# Altium schematic sheet 10_POWER.SchDoc
size A; SheetNumber: 2; SheetTotal: 8
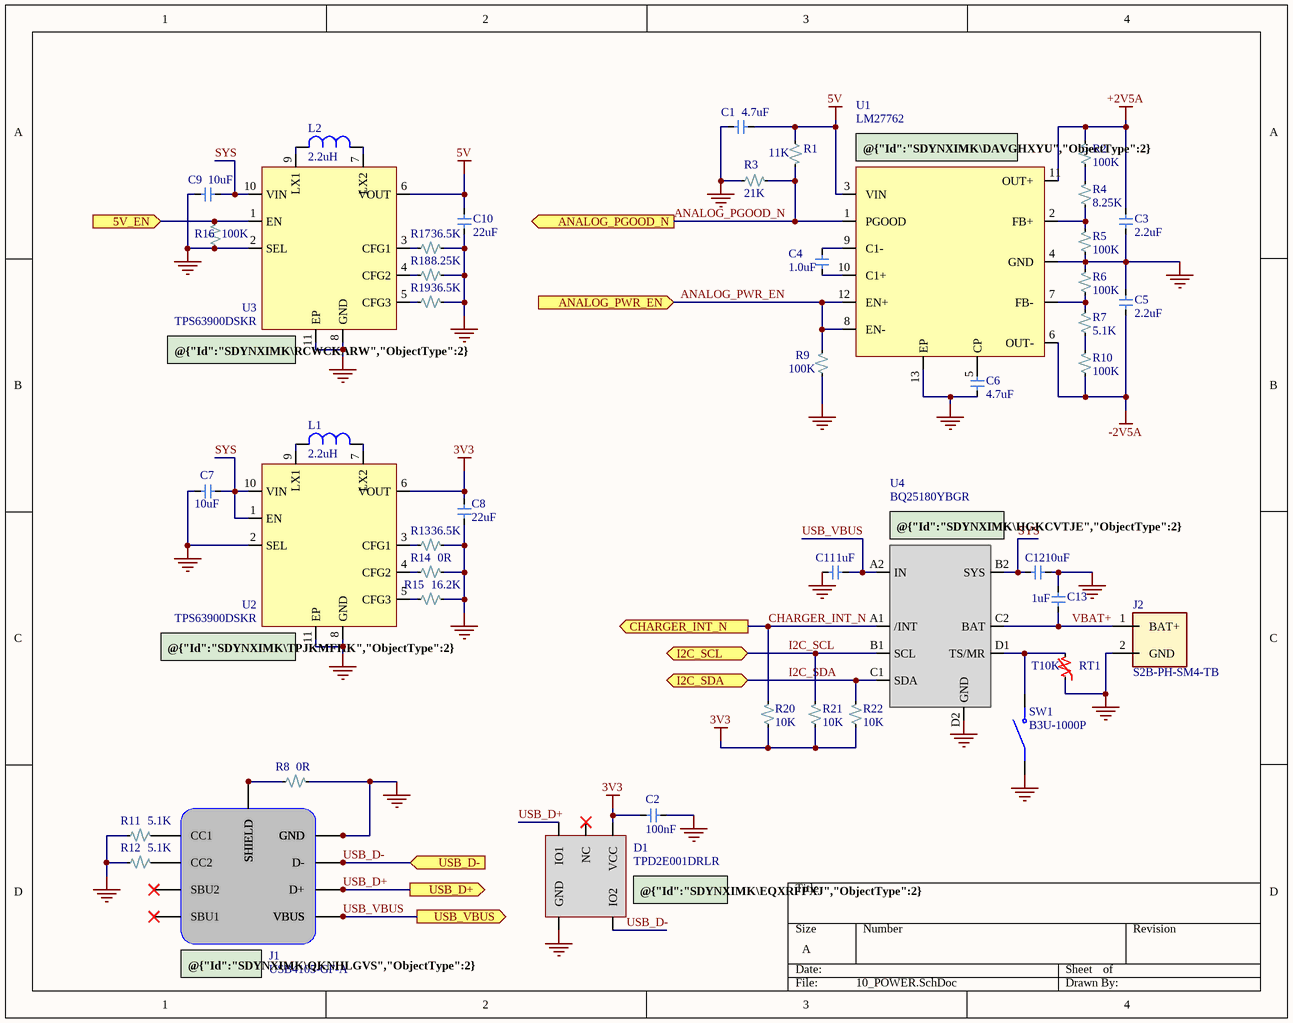
[diagram p0: 10_POWER.SchDoc]

## Parts
C1  4.7uF  [C0805]
C2  100nF  [C0805]
C3  2.2uF  [C0805]
C4  1.0uF  [C0805]
C5  2.2uF  [C0805]
C6  4.7uF  [C0805]
C7  10uF  [C0805]
C8  22uF  [C0805]
C9  10uF  [C0805]
C10  22uF  [C0805]
C11  1uF  [C0805]
C12  10uF  [C0805]
C13  1uF  [C0805]
D1  TPD2E001DRLR  [TPD2E001DRLR]
J1  USB4105-GF-A  [USB4105-GF-A]
J2  S2B-PH-SM4-TB  [S2B-PH-SM4-TB]
L1  2.2uH  [WE_PMCI_201210]
L2  2.2uH  [WE_PMCI_201210]
R1  11K  [R0805]
R2  100K  [R0805]
R3  21K  [R0805]
R4  8.25K  [R0805]
R5  100K  [R0805]
R6  100K  [R0805]
R7  5.1K  [R0805]
R8  0R  [R0805]
R9  100K  [R0805]
R10  100K  [R0805]
R11  5.1K  [R0805]
R12  5.1K  [R0805]
R13  36.5K  [R0805]
R14  0R  [R0805]
R15  16.2K  [R0805]
R16  100K  [R0805]
R17  36.5K  [R0805]
R18  8.25K  [R0805]
R19  36.5K  [R0805]
R20  10K  [R0805]
R21  10K  [R0805]
R22  10K  [R0805]
RT1  T10K  [NCU18_1608]
SW1  B3U-1000P  [B3U-1000P]
U1  LM27762  [LM27762]
U2  TPS63900DSKR  [TPS63900]
U3  TPS63900DSKR  [TPS63900]
U4  BQ25180YBGR  [BQ25180]

## Ports
5V_EN (in, see 00_SYSTEM_TOP[2B], 20_MCU_BLE[1D]), ANALOG_PGOOD_N (out, see 00_SYSTEM_TOP[2B], 20_MCU_BLE[1C]), ANALOG_PWR_EN (in, see 00_SYSTEM_TOP[2B], 20_MCU_BLE[1C]), CHARGER_INT_N (out, see 00_SYSTEM_TOP[2B], 20_MCU_BLE[1C]), I2C_SCL (bidir, see 00_SYSTEM_TOP[2B], 20_MCU_BLE[1B], 70_MODULE_INTERFACE[3C]), I2C_SDA (bidir, see 00_SYSTEM_TOP[2B], 20_MCU_BLE[1C], 70_MODULE_INTERFACE[3C]), USB_D+ (out, see 00_SYSTEM_TOP[2B], 20_MCU_BLE[2A]), USB_D- (in, see 00_SYSTEM_TOP[2B], 20_MCU_BLE[1A]), USB_VBUS (out, see 00_SYSTEM_TOP[2B], 20_MCU_BLE[2A])

## Nets
3V3: C2.1 C8.2 D1.1(VCC) R20.1 R21.1 R22.1 U2.6(VOUT)
5V: C1.1 C10.2 R1.1 U1.3(VIN) U3.6(VOUT)
+2V5A: C3.2 R2.2 U1.11(OUT+)
-2V5A: C5.2 R10.1 U1.6(OUT-)
GND: C1.2 C2.2 C3.1 C5.1 C6.1 C7.2 C8.1 C9.2 C10.1 C11.2 C12.2 C13.2 D1.4(GND) J1.A1(GND) J1.A12(GND) J1.B1(GND) J1.B12(GND) J2.2(GND) R3.1 R5.1 R6.2 R8.2 R9.1 R11.1 R12.1 R13.2 R14.2 R15.2 R16.1 R17.2 R18.2 R19.2 RT1.1 SW1.1 U1.4(GND) U1.13(EP) U2.2(SEL) U2.8(GND) U2.11(EP) U3.2(SEL) U3.8(GND) U3.11(EP) U4.D2(GND)
5V_EN: R16.2 U3.1(EN) ; port 5V_EN
ANALOG_PGOOD_N: R1.2 R3.2 U1.1(PGOOD) ; port ANALOG_PGOOD_N
ANALOG_PWR_EN: R9.2 U1.8(EN-) U1.12(EN+) ; port ANALOG_PWR_EN
CHARGER_INT_N: R20.2 U4.A1(/INT) ; port CHARGER_INT_N
I2C_SCL: R21.2 U4.B1(SCL) ; port I2C_SCL
I2C_SDA: R22.2 U4.C1(SDA) ; port I2C_SDA
SYS: C7.1 C9.1 C12.1 U2.1(EN) U2.10(VIN) U3.10(VIN) U4.B2(SYS)
USB_D+: D1.3(IO1) J1.A6(D+) J1.B6(D+) ; port USB_D+
USB_D-: D1.5(IO2) J1.A7(D-) J1.B7(D-) ; port USB_D-
USB_VBUS: C11.1 J1.A4(VBUS) J1.A9(VBUS) J1.B4(VBUS) J1.B9(VBUS) U4.A2(IN) ; port USB_VBUS
VBAT+: C13.1 J2.1(BAT+) U4.C2(BAT)
NetC4_1: C4.1 U1.10(C1+)
NetC4_2: C4.2 U1.9(C1-)
NetC6_2: C6.2 U1.5(CP)
NetJ1_A5: J1.A5(CC1) R11.2
NetJ1_B5: J1.B5(CC2) R12.2
NetJ1_SHIELD1: J1.SHIELD1(SHIELD) J1.SHIELD2(SHIELD) J1.SHIELD3(SHIELD) J1.SHIELD4(SHIELD) R8.1
NetL1_1: L1.1 U2.9(LX1)
NetL1_2: L1.2 U2.7(LX2)
NetL2_1: L2.1 U3.9(LX1)
NetL2_2: L2.2 U3.7(LX2)
NetR2_1: R2.1 R4.2
NetR4_1: R4.1 R5.2 U1.2(FB+)
NetR6_1: R6.1 R7.2 U1.7(FB-)
NetR7_1: R7.1 R10.2
NetR13_1: R13.1 U2.3(CFG1)
NetR14_1: R14.1 U2.4(CFG2)
NetR15_1: R15.1 U2.5(CFG3)
NetR17_1: R17.1 U3.3(CFG1)
NetR18_1: R18.1 U3.4(CFG2)
NetR19_1: R19.1 U3.5(CFG3)
NetRT1_2: RT1.2 SW1.2 U4.D1(TS/MR)

Not connected (* = marked no-connect by the designer): D1 2(NC)*; J1 A8(SBU1)* B8(SBU2)*

## Notes on the sheet
- (near U1) @{"Id":"SDYNXIMK\DAVGHXYU","ObjectType":2} +/- 2V5 Charge Pump
- (near U3) @{"Id":"SDYNXIMK\RCWCKARW","ObjectType":2}  5V Buck-Boost
- @{"Id":"SDYNXIMK\HGKCVTJE","ObjectType":2} LiPo Charger
- (near U2) @{"Id":"SDYNXIMK\TPJKMFHK","ObjectType":2}  3V3 Buck-Boost
- (near D1) @{"Id":"SDYNXIMK\EQXRFPXJ","ObjectType":2} USB ESD
- (near J1) @{"Id":"SDYNXIMK\QKNHLGVS","ObjectType":2} USB-C

## Library data of the parts
C1-C13 = C_0805
D1 = TPD2E001DRLR: TVS DIODE 5.5VWM SOT5; Manufacturer: Texas Instruments; Manufacturer Lifecycle Status: ACTIVE; Breakdown Voltage: 11V; Value: 1.5pF; Clamping Voltage: 105.5V; Direction: Unidirectional; Element Configuration: Dual; Interface: Ethernet, LVDS; Leakage Current: 1nA; Max Junction Temperature (Tj): 150°C; Max Supply Voltage: 5.5V; Min Supply Voltage: 900mV; Number of Bidirectional Channels: 2; Peak Pulse Current: 10A; Power Line Protection: Yes; Supplier: DigiKey; Supplier Part Number: 296-21883-1-ND; Manufacturer Part Number: TPD2E001DRLR; RoHS: Compliant; Category: TVS Diodes; Stock: 58515; Pricing: 1=0.94, 10=0.581, 50=0.426, 100=0.3757, 500=0.28718, 4000=0.21438, 12000=0.1887 (USD); Ambient Temperature Range High: 85°C; Case/Package: SOT; Contact Plating: Gold; Depth: 1.2mm; Height: 0m; Lead Free: Lead Free; Length: 1.6mm; Lifecycle Status: Production; Max Operating Temperature: 85°C; Min Breakdown Voltage: 11V; Min Operating Temperature: -40°C; Number of Channels: 2; Number of Outputs: 2; Pins: 5; Operating Supply Voltage: 5.5V; Polarity: Unidirectional; Radiation Hardening: No; REACH SVHC: No; Reverse Standoff Voltage: 5.5V; Schedule B: 8541100080, 8541100080|8541100080|8541100080|8541100080|8541100080; Termination: SMD/SMT; Thickness: 550µm; Weight: 2.806603mg; Width: 1.2mm; Working Voltage: 5.5V; ComponentLink1URL: https://sigma.octopart.com:443/181443230/technical_drawing/Texas-Instruments-TPD2E001DRLR.pdf?src-supplier=Texas+Instruments; ComponentLink1Description: https://sigma.octopart.com:443/181443230/technical_drawing/Texas-Instruments-TPD2E001DRLR.pdf?src-supplier=Texas+Instruments; ComponentLink2URL: https://octopart.com:443/opatz8j6/c1?t=LqR2T5dhtvY9fnpxm98ZmwTx2KiqwpTyiDh4fmM8LmA1Hdyy6Z2mouOGGfsyM_omQ8P5IG0puZB1FIHZzhg0KJLvuNDHe3DDIqJ06AtV8pixDYd3BFmVklDIB3kX-o173eNR4-Luk47j3Y2XPujUjAfL1QiTI-7Lwb7SjnJyfkP_0unbRDdGCGpXHS615Fdjh3G7NsLJ85TzDAC1d_IMlnk34_uqrgLYYqRua-puyyypeO8uz9sLuYmHH6Sbc_DvL2ro0fk8buRAQwE3oFAo5beh5rCnqbsY_N3VX2fm8SsZ707DKbb4CQjIrKArFyjIUZXCjzc8_URAOlXvyifWFdRvtoDMS1TxXzD8kCEUEJBHoB0mYqXmgSj3ODXeASq6-Iu83Q&src-supplier=Texas+Instruments; ComponentLink2Description: https://octopart.com:443/opatz8j6/c1?t=LqR2T5dhtvY9fnpxm98ZmwTx2KiqwpTyiDh4fmM8LmA1Hdyy6Z2mouOGGfsyM_omQ8P5IG0puZB1FIHZzhg0KJLvuNDHe3DDIqJ06AtV8pixDYd3BFmVklDIB3kX-o173eNR4-Luk47j3Y2XPujUjAfL1QiTI-7Lwb7SjnJyfkP_0unbRDdGCGpXHS615Fdjh3G7NsLJ85TzDAC1d_IMlnk34_uqrgLYYqRua-puyyypeO8uz9sLuYmHH6Sbc_DvL2ro0fk8buRAQwE3oFAo5beh5rCnqbsY_N3VX2fm8SsZ707DKbb4CQjIrKArFyjIUZXCjzc8_URAOlXvyifWFdRvtoDMS1TxXzD8kCEUEJBHoB0mYqXmgSj3ODXeASq6-Iu83Q&src-supplier=Texas+Instruments; ComponentLink3URL: https://datasheet.octopart.com:443/TPD2E001DRLR-Texas-Instruments-datasheet-37738713.pdf?src-supplier=Texas+Instruments; ComponentLink3Description: https://datasheet.octopart.com:443/TPD2E001DRLR-Texas-Instruments-datasheet-37738713.pdf?src-supplier=Texas+Instruments; ComponentLink4URL: https://sigma.octopart.com:443/178868977/technical_drawing/Texas-Instruments-TPD2E001DRLR.pdf?src-supplier=Texas+Instruments; ComponentLink4Description: https://sigma.octopart.com:443/178868977/technical_drawing/Texas-Instruments-TPD2E001DRLR.pdf?src-supplier=Texas+Instruments; ComponentLink5URL: https://sigma.octopart.com:443/149978402/technical_drawing/Texas-Instruments-TPD2E001DRLR.pdf?src-supplier=Texas+Instruments; ComponentLink5Description: https://sigma.octopart.com:443/149978402/technical_drawing/Texas-Instruments-TPD2E001DRLR.pdf?src-supplier=Texas+Instruments; ComponentLink6URL: https://datasheet.octopart.com:443/TPD2E001DRLR-Texas-Instruments-datasheet-21096186.pdf?src-supplier=Texas+Instruments; ComponentLink6Description: https://datasheet.octopart.com:443/TPD2E001DRLR-Texas-Instruments-datasheet-21096186.pdf?src-supplier=Texas+Instruments; ComponentLink7URL: https://datasheet.octopart.com:443/TPD2E001DRLR-Texas-Instruments-datasheet-10824604.pdf?src-supplier=Texas+Instruments; ComponentLink7Description: https://datasheet.octopart.com:443/TPD2E001DRLR-Texas-Instruments-datasheet-10824604.pdf?src-supplier=Texas+Instruments; ComponentLink8URL: https://datasheet.octopart.com:443/TPD2E001DRLR-Texas-Instruments-datasheet-10670688.pdf?src-supplier=Texas+Instruments; ComponentLink8Description: https://datasheet.octopart.com:443/TPD2E001DRLR-Texas-Instruments-datasheet-10670688.pdf?src-supplier=Texas+Instruments; ComponentLink9URL: https://datasheet.octopart.com:443/TPD2E001DRLR-Texas-Instruments-datasheet-10258578.pdf?src-supplier=Texas+Instruments; ComponentLink9Description: https://datasheet.octopart.com:443/TPD2E001DRLR-Texas-Instruments-datasheet-10258578.pdf?src-supplier=Texas+Instruments; ComponentLink10URL: https://datasheet.octopart.com:443/TPD2E001DRLR-Texas-Instruments-datasheet-153022.pdf?src-supplier=Texas+Instruments; ComponentLink10Description: https://datasheet.octopart.com:443/TPD2E001DRLR-Texas-Instruments-datasheet-153022.pdf?src-supplier=Texas+Instruments; ComponentLink11URL: https://sigma.octopart.com:443/49249896/technical_drawing/Texas-Instruments-TPD2E001DRLR.pdf?src-supplier=Texas+Instruments; ComponentLink11Description: https://sigma.octopart.com:443/49249896/technical_drawing/Texas-Instruments-TPD2E001DRLR.pdf?src-supplier=Texas+Instruments; ComponentLink12URL: https://datasheet.octopart.com:443/TPD2E001DRLR-Texas-Instruments-datasheet-32015767.pdf?src-supplier=Farnell; ComponentLink12Description: https://datasheet.octopart.com:443/TPD2E001DRLR-Texas-Instruments-datasheet-32015767.pdf?src-supplier=Farnell; ComponentLink13URL: https://datasheet.octopart.com:443/TPD2E001DRLR-Texas-Instruments-datasheet-12491271.pdf?src-supplier=Farnell; ComponentLink13Description: https://datasheet.octopart.com:443/TPD2E001DRLR-Texas-Instruments-datasheet-12491271.pdf?src-supplier=Farnell; ComponentLink14URL: https://datasheet.octopart.com:443/TPD2E001DRLR-Texas-Instruments-datasheet-66807720.pdf?src-supplier=Farnell; ComponentLink14Description: https://datasheet.octopart.com:443/TPD2E001DRLR-Texas-Instruments-datasheet-66807720.pdf?src-supplier=Farnell; ComponentLink15URL: https://datasheet.octopart.com:443/TPD2E001DRLR-Texas-Instruments-datasheet-24570227.pdf?src-supplier=Farnell; ComponentLink15Description: https://datasheet.octopart.com:443/TPD2E001DRLR-Texas-Instruments-datasheet-24570227.pdf?src-supplier=Farnell; ComponentLink16URL: https://datasheet.octopart.com:443/TPD2E001DRLR-Texas-Instruments-datasheet-16079961.pdf?src-supplier=Newark; ComponentLink16Description: https://datasheet.octopart.com:443/TPD2E001DRLR-Texas-Instruments-datasheet-16079961.pdf?src-supplier=Newark; ComponentLink17URL: https://datasheet.octopart.com:443/TPD2E001DRLR-Texas-Instruments-datasheet-159117907.pdf?src-supplier=LCSC; ComponentLink17Description: https://datasheet.octopart.com:443/TPD2E001DRLR-Texas-Instruments-datasheet-159117907.pdf?src-supplier=LCSC; ComponentLink18URL: https://datasheet.octopart.com:443/TPD2E001DRLR-Texas-Instruments-datasheet-137316104.pdf?src-supplier=Future+Electronics; ComponentLink18Description: https://datasheet.octopart.com:443/TPD2E001DRLR-Texas-Instruments-datasheet-137316104.pdf?src-supplier=Future+Electronics; ComponentLink19URL: https://datasheet.octopart.com:443/TPD2E001DRLR-Texas-Instruments-datasheet-14047829.pdf?src-supplier=iiiC; ComponentLink19Description: https://datasheet.octopart.com:443/TPD2E001DRLR-Texas-Instruments-datasheet-14047829.pdf?src-supplier=iiiC; ComponentLink20URL: http://sigma.octopart.com:80/reach_statement/Texas-Instruments-company-64.pdf?src-supplier=Compliance+Statements; ComponentLink20Description: http://sigma.octopart.com:80/reach_statement/Texas-Instruments-company-64.pdf?src-supplier=Compliance+Statements; ComponentLink21URL: http://sigma.octopart.com:80/conflict_mineral_statement/Texas-Instruments-company-63.pdf?src-supplier=Compliance+Statements; ComponentLink21Description: http://sigma.octopart.com:80/conflict_mineral_statement/Texas-Instruments-company-63.pdf?src-supplier=Compliance+Statements
J1 = USB4105-GF-A: USB Connector, 24 Contact(s), Female, Right Angle, Solder Terminal, Locking, Receptacle; Manufacturer: Global Connector Technology; Contact Resistance: 50mΩ; Current Rating: 6.25A; Dielectric Material: Liquid Crystal Polymer; Insulation Resistance: 100MΩ; Number of Contacts: 16; Number of Ports: 1; Number of Positions: 24; USB Standard: USB 2.0; Voltage Rating: 20V; Supplier: DigiKey; Supplier Part Number: 2073-USB4105-GF-ADKR-ND; Manufacturer Part Number: USB4105-GF-A; RoHS: Compliant; Category: USB Connectors; Stock: 132497; Pricing: 1=0.8, 10=0.676, 25=0.6336, 50=0.6034, 100=0.5745, 250=0.53848 (USD); China RoHS: Compliant; Contact Material: Gold, Nickel; Country of Origin: Mainland China; Export Control Classification Number (ECCN) Code: EAR99; Gender: Female; Height: 3.46mm; Harmonized Tariff Schedule (HTS) Code: 8536.69.40.30; Insulation Color: Black; Introduction Date: 2021-04-29; Lifecycle Status: Production; Max Operating Temperature: 85°C; Min Operating Temperature: -40°C; Pins: 16; Number of Rows: 1; Orientation: Right Angle; REACH SVHC: Yes; Shell Finish: Nickel; Shell Material: Stainless Steel; Terminal Pitch: 500µm; ComponentLink1URL: https://datasheet.octopart.com:443/USB4105-GF-A-GCT-datasheet-166929323.pdf?src-supplier=SOS+electronic; ComponentLink1Description: https://datasheet.octopart.com:443/USB4105-GF-A-GCT-datasheet-166929323.pdf?src-supplier=SOS+electronic; ComponentLink2URL: https://datasheet.octopart.com:443/USB4105-GF-A-GCT-datasheet-188935996.pdf?src-supplier=TME; ComponentLink2Description: https://datasheet.octopart.com:443/USB4105-GF-A-GCT-datasheet-188935996.pdf?src-supplier=TME; ComponentLink3URL: https://datasheet.octopart.com:443/USB4105-GF-A-GCT-datasheet-188869076.pdf?src-supplier=TME; ComponentLink3Description: https://datasheet.octopart.com:443/USB4105-GF-A-GCT-datasheet-188869076.pdf?src-supplier=TME; ComponentLink4URL: https://datasheet.octopart.com:443/USB4105-GF-A-GCT-datasheet-166927665.pdf?src-supplier=TME; ComponentLink4Description: https://datasheet.octopart.com:443/USB4105-GF-A-GCT-datasheet-166927665.pdf?src-supplier=TME
J2 = S2B-PH-SM4-TB: Board Connector, 2 Contact(s), 1 Row(s), Male, Right Angle, Surface Mount Terminal; Manufacturer: JST; Contact Resistance: 20mΩ; Current Rating: 2A; Dielectric Material: Polyamide; Insulation Resistance: 1GΩ; Number of Poles: 2; Pitch: 2.0066mm; Ratings: CSA, TUV; Supplier: DigiKey; Supplier Part Number: 455-S2B-PH-SM4-TBDKR-ND; Manufacturer Part Number: S2B-PH-SM4-TB; RoHS: Compliant; Category: Card Edge Connectors; Stock: 179159; Pricing: 1=0.49, 10=0.417, 100=0.3547, 500=0.31654 (USD); Case/Package: SMD/SMT; Contact Plating: Tin; Gender: Male; Height: 5.5mm; Length: 7.9mm; Lifecycle Status: Production; Max Operating Temperature: 85°C; Min Operating Temperature: -25°C; Pins: 2; Number of Positions: 2; Number of Rows: 1; Orientation: Right Angle; Terminal Pitch: 2mm; Width: 7.6mm; ComponentLink1URL: https://datasheet.octopart.com:443/S2B-PH-SM4-TB-JST-datasheet-15068535.pdf?src-supplier=IHS; ComponentLink1Description: https://datasheet.octopart.com:443/S2B-PH-SM4-TB-JST-datasheet-15068535.pdf?src-supplier=IHS; ComponentLink2URL: https://datasheet.octopart.com:443/S2B-PH-SM4-TB-JST-datasheet-12510261.pdf?src-supplier=TME; ComponentLink2Description: https://datasheet.octopart.com:443/S2B-PH-SM4-TB-JST-datasheet-12510261.pdf?src-supplier=TME; ComponentLink3URL: https://datasheet.octopart.com:443/S2B-PH-SM4-TB-JST-datasheet-159515011.pdf?src-supplier=HQonline; ComponentLink3Description: https://datasheet.octopart.com:443/S2B-PH-SM4-TB-JST-datasheet-159515011.pdf?src-supplier=HQonline
L1 L2 = 74479275222: FIXED IND 2.2UH 2A 190 MOHM SMD; Manufacturer: Wurth Elektronik; Manufacturer Lifecycle Status: ACTIVE; Current Rating: 1A; DC Resistance (DCR): 166mΩ; Value: 2.2µH; Inductance Tolerance: 20%; RMS Current (Irms): 1.3A; Saturation Current: 1.2A; Self Resonant Frequency: 40MHz; ESR: 176mΩ; Shielding: Shielded; Test Frequency: 1MHz; YEOL: 1 = Estimated lifetime > 10 years; Supplier: DigiKey; Supplier Part Number: 732-9708-1-ND; Manufacturer Part Number: 74479275222; RoHS: Compliant; Category: Fixed Inductors; Stock: 6231; Pricing: 1=1.27, 50=1.056, 100=0.915, 1000=0.832 (USD); Ambient Temperature Range High: 85°C; Ambient Temperature Range Low: -40°C; Case/Package: 0805; Case Code (Imperial): 0805; Case Code (Metric): 2012; Height: 1mm; Height - Seated (Max): 1.4478mm; Length: 2mm; Lifecycle Status: Production; Max Operating Temperature: 125°C; Min Operating Temperature: -40°C; Mounting Technology: Surface Mount; Pins: 2; REACH SVHC: Unknown; Tolerance: 20%; Width: 1.25mm; ComponentLink1URL: https://datasheet.octopart.com:443/74479275222-W%C3%BCrth-Elektronik-datasheet-155263601.pdf?src-supplier=Wurth+Elektronik; ComponentLink1Description: https://datasheet.octopart.com:443/74479275222-W%C3%BCrth-Elektronik-datasheet-155263601.pdf?src-supplier=Wurth+Elektronik; ComponentLink2URL: https://datasheet.octopart.com:443/74479275222-Wurth-Elektronik-datasheet-181536646.pdf?src-supplier=Newark; ComponentLink2Description: https://datasheet.octopart.com:443/74479275222-Wurth-Elektronik-datasheet-181536646.pdf?src-supplier=Newark; ComponentLink3URL: https://datasheet.octopart.com:443/74479275222-W%C3%BCrth-Elektronik-datasheet-62333429.pdf?src-supplier=element14+APAC; ComponentLink3Description: https://datasheet.octopart.com:443/74479275222-W%C3%BCrth-Elektronik-datasheet-62333429.pdf?src-supplier=element14+APAC
R1-R22 = R_0805: RES 1/8W 0805; Manufacturer: Stackpole Electronics; Manufacturer Part Number: RNCF0805TKY10K0; Manufacturer Package Identifier: 0805 (2012 metric); Max Power Dissipation: 125mW; Value: 10kΩ; Temperature Coefficient: 5ppm/°C; Tolerance: 0.01%; Working Voltage: 150V; Supplier: DigiKey; Supplier Part Number: RNCF0805TKY10K0CT-ND; RoHS: Compliant; Category: Chip SMD Resistors; Stock: 4649; Pricing: 1=1.61, 10=1.334, 50=1.1716, 100=1.1105, 500=0.99044, 1000=0.94751, 2000=0.90945, 3000=0.8893, 5000=0.86599, 7000=0.85183, 10000=0.8378 (USD); Case/Package: 0805; Case Code (Imperial): 0805; Case Code (Metric): 2012; Composition: Thin Film; Country of Origin: Taiwan; Export Control Classification Number (ECCN) Code: EAR99; Features: Moisture Resistant; Height: 550µm; Harmonized Tariff Schedule (HTS) Code: 8533.21.00.30; Introduction Date: 2011-06-03; Lead Free: Lead Free; Length: 2mm; Lifecycle Status: Production; Max Operating Temperature: 155°C; Min Operating Temperature: -55°C; Mounting Technology: Surface Mount; Number of Terminals: 2; Number of Terminations: 2; Packaging: Tape & Reel (TR); Power Rating: 125mW; Ratings: AEC-Q200; REACH SVHC: Yes; Schedule B: 8533210045, 8533210045|8533210045|8533210045|8533210045|8533210045; Width: 1.25mm; ComponentLink1URL: https://datasheet.octopart.com:443/RNCF0805TKY10K0-Stackpole-Electronics-datasheet-182148124.pdf?src-supplier=IHS; ComponentLink1Description: https://datasheet.octopart.com:443/RNCF0805TKY10K0-Stackpole-Electronics-datasheet-182148124.pdf?src-supplier=IHS; ComponentLink2URL: https://datasheet.octopart.com:443/RNCF0805TKY10K0-Stackpole-Electronics-datasheet-12511394.pdf?src-supplier=Factory+Futures; ComponentLink2Description: https://datasheet.octopart.com:443/RNCF0805TKY10K0-Stackpole-Electronics-datasheet-12511394.pdf?src-supplier=Factory+Futures; ComponentLink3URL: https://datasheet.octopart.com:443/RNCF0805TKY10K0-Stackpole-Electronics-datasheet-141158876.pdf?src-supplier=Stackpole+Electronics; ComponentLink3Description: https://datasheet.octopart.com:443/RNCF0805TKY10K0-Stackpole-Electronics-datasheet-141158876.pdf?src-supplier=Stackpole+Electronics; ComponentLink4URL: https://datasheet.octopart.com:443/RNCF0805TKY10K0-Stackpole-Electronics-datasheet-28504821.pdf?src-supplier=Master+Electronics; ComponentLink4Description: https://datasheet.octopart.com:443/RNCF0805TKY10K0-Stackpole-Electronics-datasheet-28504821.pdf?src-supplier=Master+Electronics; ComponentLink5URL: https://datasheet.octopart.com/RNCF0805TKY10K0-Stackpole-Electronics-datasheet-11755897.pdf; ComponentLink5Description: https://datasheet.octopart.com/RNCF0805TKY10K0-Stackpole-Electronics-datasheet-11755897.pdf; ComponentLink6URL: http://sigma.octopart.com:80/15941409/materials_sheet/Stackpole-Electronics-RNCF0805TKY10K0.pdf?src-supplier=Compliance+Statements; ComponentLink6Description: http://sigma.octopart.com:80/15941409/materials_sheet/Stackpole-Electronics-RNCF0805TKY10K0.pdf?src-supplier=Compliance+Statements; ComponentLink7URL: http://sigma.octopart.com:80/141158212/rohs_statement/Stackpole-Electronics-RNCF0805TKY10K0.pdf?src-supplier=Compliance+Statements; ComponentLink7Description: http://sigma.octopart.com:80/141158212/rohs_statement/Stackpole-Electronics-RNCF0805TKY10K0.pdf?src-supplier=Compliance+Statements; ComponentLink8URL: http://sigma.octopart.com:80/141158211/reach_statement/Stackpole-Electronics-RNCF0805TKY10K0.pdf?src-supplier=Compliance+Statements; ComponentLink8Description: http://sigma.octopart.com:80/141158211/reach_statement/Stackpole-Electronics-RNCF0805TKY10K0.pdf?src-supplier=Compliance+Statements
RT1 = NCU18XH103F6SRB: THERMISTOR NTC 10KOHM 3380K 0603 / NTC Thermistor 10k 0603 (1608 Metric); Manufacturer: Murata; Max Current Rating: 100µA; Value: 10kΩ; Tolerance: 1%; Voltage Rating: 5V; Supplier: DigiKey; Supplier Part Number: 490-18139-6-ND; Manufacturer Part Number: NCU18XH103F6SRB; RoHS: Compliant; Category: Variable Resistors and Potentiometers; Stock: 103374; Pricing: 1=0.14, 5=0.124, 10=0.117, 25=0.1076, 50=0.1016, 100=0.096, 500=0.08492, 1000=0.08083 (USD); Case/Package: 0603; Case Code (Imperial): 0603; Case Code (Metric): 1608; Export Control Classification Number (ECCN) Code: EAR99; Height: 800µm; Harmonized Tariff Schedule (HTS) Code: 8533.40.80.70; Introduction Date: 2016-05-16; Length: 1.6mm; Lifecycle Status: Production; Max Operating Temperature: 150°C; Min Operating Temperature: -55°C; Mounting Technology: Surface Mount; Number of Terminals: 2; Ratings: AEC-Q200; REACH SVHC: Yes; Schedule B: 8533400080, 8533400080|8533400080, 8533400080|8533400080|8533400080, 8533400080|8533400080|8533400080|8533400080; Width: 800µm; Working Voltage: 5V; ComponentLink1URL: https://datasheet.octopart.com:443/NCU18XH103F6SRB-Murata-datasheet-182145414.pdf?src-supplier=IHS; ComponentLink1Description: https://datasheet.octopart.com:443/NCU18XH103F6SRB-Murata-datasheet-182145414.pdf?src-supplier=IHS; ComponentLink2URL: https://datasheet.octopart.com:443/NCU18XH103F6SRB-Murata-datasheet-65933868.pdf?src-supplier=Newark; ComponentLink2Description: https://datasheet.octopart.com:443/NCU18XH103F6SRB-Murata-datasheet-65933868.pdf?src-supplier=Newark; ComponentLink3URL: https://datasheet.octopart.com:443/NCU18XH103F6SRB-Murata-datasheet-181958153.pdf?src-supplier=Farnell; ComponentLink3Description: https://datasheet.octopart.com:443/NCU18XH103F6SRB-Murata-datasheet-181958153.pdf?src-supplier=Farnell; ComponentLink4URL: https://datasheet.octopart.com:443/NCU18XH103F6SRB-Murata-datasheet-138710245.pdf?src-supplier=ODG+(Origin+Data+Global); ComponentLink4Description: https://datasheet.octopart.com:443/NCU18XH103F6SRB-Murata-datasheet-138710245.pdf?src-supplier=ODG+(Origin+Data+Global); ComponentLink5URL: https://datasheet.octopart.com:443/NCU18XH103F6SRB-Murata-datasheet-141294565.pdf?src-supplier=Ciiva; ComponentLink5Description: https://datasheet.octopart.com:443/NCU18XH103F6SRB-Murata-datasheet-141294565.pdf?src-supplier=Ciiva; ComponentLink6URL: https://datasheet.octopart.com:443/NCU18XH103F6SRB-Murata-datasheet-165611801.pdf?src-supplier=TME; ComponentLink6Description: https://datasheet.octopart.com:443/NCU18XH103F6SRB-Murata-datasheet-165611801.pdf?src-supplier=TME; ComponentLink7URL: http://sigma.octopart.com:80/reach_statement/Murata-company-16.pdf?src-supplier=Compliance+Statements; ComponentLink7Description: http://sigma.octopart.com:80/reach_statement/Murata-company-16.pdf?src-supplier=Compliance+Statements
SW1 = B3U-1000P: Switch Tactile N.O. SPST Round Button Solder Tab 12VDC 200000Cycles 1.5N SMD Emboss T/R; Manufacturer: Omron; Manufacturer Package Identifier: B3U-1000P(M); Actuator Length: 400µm; Contact Current Rating: 50mA; Contact Resistance: 100mΩ; Electrical Life: 200kcycles; Illumination Type: Illuminated, Non-Illuminated; Max Voltage Rating (DC): 12V; Number of Positions: 1; Operating Force: 1.99N; Ratings: Dust Proof, IP40; Sealable: DUST PROOF; Switch Function: Off-Mom; Switch Travel: 150µm; Supplier: Arrow Electronics; Supplier Part Number: B3U-1000P; Manufacturer Part Number: B3U-1000P; RoHS: Compliant; Category: Tactile Switches; Stock: 392000; Pricing: 3500=0.5448, 7000=0.5014 (USD); Ambient Temperature Range High: 70°C; Color: Silver; Contact Material: Silver; Contact Plating: Silver; Current Rating: 50mA; Depth: 2.5mm; Height: 1.2mm; Insulation Resistance: 100MΩ; Lead Free: Lead Free; Length: 3mm; Life (Cycles): 200kcycles; Lifecycle Status: Production; Max Current Rating: 50mA; Max Operating Temperature: 70°C; Mechanical Life: 200kcycles; Min Operating Temperature: -25°C; Mounting Technology: Surface Mount; Pins: 2; Packaging: Tape and Reel; REACH SVHC: Yes; Termination: Solder; Throw Configuration: SPST; Voltage Rating (DC): 12V; Weight: 21.99923mg; Width: 2.5mm; ComponentLink1URL: https://datasheet.octopart.com:443/B3U-1000P-Omron-datasheet-62106914.pdf?src-supplier=IHS; ComponentLink1Description: https://datasheet.octopart.com:443/B3U-1000P-Omron-datasheet-62106914.pdf?src-supplier=IHS; ComponentLink2URL: https://datasheet.octopart.com:443/B3U-1000P-Omron-datasheet-10910421.pdf?src-supplier=RS+(Formerly+Allied+Electronics); ComponentLink2Description: https://datasheet.octopart.com:443/B3U-1000P-Omron-datasheet-10910421.pdf?src-supplier=RS+(Formerly+Allied+Electronics); ComponentLink3URL: https://datasheet.octopart.com:443/B3U-1000P-Omron-datasheet-5458533.pdf?src-supplier=Upverter; ComponentLink3Description: https://datasheet.octopart.com:443/B3U-1000P-Omron-datasheet-5458533.pdf?src-supplier=Upverter; ComponentLink4URL: https://datasheet.octopart.com:443/B3U-1000P-Omron-datasheet-11968313.pdf?src-supplier=SOS+electronic; ComponentLink4Description: https://datasheet.octopart.com:443/B3U-1000P-Omron-datasheet-11968313.pdf?src-supplier=SOS+electronic; ComponentLink5URL: https://datasheet.octopart.com:443/B3U-1000P-Omron-datasheet-110759174.pdf?src-supplier=Newark; ComponentLink5Description: https://datasheet.octopart.com:443/B3U-1000P-Omron-datasheet-110759174.pdf?src-supplier=Newark; ComponentLink6URL: https://datasheet.octopart.com:443/B3U-1000P-Omron-datasheet-506776.pdf?src-supplier=Newark; ComponentLink6Description: https://datasheet.octopart.com:443/B3U-1000P-Omron-datasheet-506776.pdf?src-supplier=Newark; ComponentLink7URL: https://datasheet.octopart.com:443/B3U-1000P-Omron-datasheet-17589256.pdf?src-supplier=TME; ComponentLink7Description: https://datasheet.octopart.com:443/B3U-1000P-Omron-datasheet-17589256.pdf?src-supplier=TME
U1 = LM27762DSSR: IC REG CHARGE PUMP ADJ DL 12WSON; Manufacturer: Texas Instruments; Manufacturer Lifecycle Status: ACTIVE; Max Junction Temperature (Tj): 125°C; Max Supply Voltage: 5.5V; Min Supply Voltage: 2.7V; Nominal Supply Current: 390µA; Number of Outputs: 2; Output Current: 250mA; Switching Frequency: 2MHz; Supplier: DigiKey; Supplier Part Number: 296-47331-1-ND; Manufacturer Part Number: LM27762DSSR; RoHS: Compliant; Category: Voltage Regulators - Linear; Stock: 13224; Pricing: 1=2.31, 10=1.71, 25=1.56, 100=1.3951, 250=1.3166, 500=1.27756 (USD); Ambient Temperature Range High: 85°C; Height: 800µm; Lead Free: Lead Free; Length: 2mm; Lifecycle Status: Production; Max Operating Temperature: 85°C; Min Operating Temperature: -40°C; Pins: 12; Quiescent Current: 390µA; Schedule B: 8542390000, 8542390000|8542390000|8542390000|8542390000|8542390000|8542390000|8542390000|8542390000|8542390000|8542390000|8542390000|8542390000|8542390000|8542390000|8542390000|8542390000|8542390000|8542390000|8542390000|8542390000|8542390000|8542390000|8542390000|85; Thickness: 750µm; Topology: Charge Pump; Width: 3mm; ComponentLink1URL: https://sigma.octopart.com:443/81678663/technical_drawing/Texas-Instruments-LM27762DSSR.pdf?src-supplier=Texas+Instruments; ComponentLink1Description: https://sigma.octopart.com:443/81678663/technical_drawing/Texas-Instruments-LM27762DSSR.pdf?src-supplier=Texas+Instruments; ComponentLink2URL: https://octopart.com:443/opatz8j6/c1?t=qGW3fZh6rbzjUEzWZb6D8x9Jd9q3NO4LuKNvuUXcmNXskur0gYfHNShI7YjLnZogpd9ODFUKBHAv0xEzrjgN1BrsAvb29dPQQtindGASqOiPvbwzUittcVayaRgSMCg2PyURFa49judjR-51k2Tshh2avWoGwgQTauKHgHZEW1Mi2Ud_2FxC8vdIlRVQjGWOBt96NojCfVSAyBJQfCKlmTnPWgt58ShaVxaP5ZSWMNo2UvVyuLyEyCOAoev3GSskx9qmSgTKhJ3cbX_JDZZZwra_UfmHMAAkkgUJY6mu---dDSxqTCFw1RGrjYUCVaQP1B7olnvSIU_HpNn-bohxhx31vydGjWcs0o-BEum2ZwS4owcBlLlUIutb_ZCv9KPs3-sdHNg&src-supplier=Texas+Instruments; ComponentLink2Description: https://octopart.com:443/opatz8j6/c1?t=qGW3fZh6rbzjUEzWZb6D8x9Jd9q3NO4LuKNvuUXcmNXskur0gYfHNShI7YjLnZogpd9ODFUKBHAv0xEzrjgN1BrsAvb29dPQQtindGASqOiPvbwzUittcVayaRgSMCg2PyURFa49judjR-51k2Tshh2avWoGwgQTauKHgHZEW1Mi2Ud_2FxC8vdIlRVQjGWOBt96NojCfVSAyBJQfCKlmTnPWgt58ShaVxaP5ZSWMNo2UvVyuLyEyCOAoev3GSskx9qmSgTKhJ3cbX_JDZZZwra_UfmHMAAkkgUJY6mu---dDSxqTCFw1RGrjYUCVaQP1B7olnvSIU_HpNn-bohxhx31vydGjWcs0o-BEum2ZwS4owcBlLlUIutb_ZCv9KPs3-sdHNg&src-supplier=Texas+Instruments; ComponentLink3URL: https://sigma.octopart.com:443/49250719/technical_drawing/Texas-Instruments-LM27762DSSR.pdf?src-supplier=Texas+Instruments; ComponentLink3Description: https://sigma.octopart.com:443/49250719/technical_drawing/Texas-Instruments-LM27762DSSR.pdf?src-supplier=Texas+Instruments; ComponentLink4URL: https://datasheet.octopart.com:443/LM27762DSSR-Texas-Instruments-datasheet-159115144.pdf?src-supplier=LCSC; ComponentLink4Description: https://datasheet.octopart.com:443/LM27762DSSR-Texas-Instruments-datasheet-159115144.pdf?src-supplier=LCSC; ComponentLink5URL: https://datasheet.octopart.com:443/LM27762DSSR-Texas-Instruments-datasheet-164414993.pdf?src-supplier=SHENGYU+ELECTRONICS; ComponentLink5Description: https://datasheet.octopart.com:443/LM27762DSSR-Texas-Instruments-datasheet-164414993.pdf?src-supplier=SHENGYU+ELECTRONICS; ComponentLink6URL: https://datasheet.octopart.com:443/LM27762DSSR-Texas-Instruments-datasheet-150873029.pdf?src-supplier=Arrow.cn; ComponentLink6Description: https://datasheet.octopart.com:443/LM27762DSSR-Texas-Instruments-datasheet-150873029.pdf?src-supplier=Arrow.cn; ComponentLink7URL: https://datasheet.octopart.com:443/LM27762DSSR-Texas-Instruments-datasheet-137316104.pdf?src-supplier=Future+Electronics; ComponentLink7Description: https://datasheet.octopart.com:443/LM27762DSSR-Texas-Instruments-datasheet-137316104.pdf?src-supplier=Future+Electronics; ComponentLink8URL: http://sigma.octopart.com:80/reach_statement/Texas-Instruments-company-64.pdf?src-supplier=Compliance+Statements; ComponentLink8Description: http://sigma.octopart.com:80/reach_statement/Texas-Instruments-company-64.pdf?src-supplier=Compliance+Statements; ComponentLink9URL: http://sigma.octopart.com:80/conflict_mineral_statement/Texas-Instruments-company-63.pdf?src-supplier=Compliance+Statements; ComponentLink9Description: http://sigma.octopart.com:80/conflict_mineral_statement/Texas-Instruments-company-63.pdf?src-supplier=Compliance+Statements
U2 U3 = TPS63900DSKR: Buck-Boost Yes 2MHz Programmable 1 5V 1.8V 5.5V 1.8V WFDFN-10(EP) SMD mount，glue mount; Manufacturer: Texas Instruments; Manufacturer Lifecycle Status: ACTIVE; Max Duty Cycle: 99%; Max Junction Temperature (Tj): 125°C; Nominal Supply Current: 75nA; Number of Outputs: 1; Output Current: 400mA; Supplier: DigiKey; Supplier Part Number: 296-TPS63900DSKRCT-ND; Manufacturer Part Number: TPS63900DSKR; RoHS: Compliant; Category: Voltage Regulators - Switching; Stock: 32045; Pricing: 1=2.74, 10=2.042, 25=1.8668, 100=1.6749, 250=1.5834, 500=1.54836, 3000=1.42668, 6000=1.39922 (USD); Ambient Temperature Range High: 85°C; Height: 800µm; Length: 2.5mm; Lifecycle Status: Production; Max Operating Temperature: 125°C; Max Supply Voltage: 5.5V; Min Operating Temperature: -40°C; Min Supply Voltage: 1.8V; Pins: 10; Thickness: 750µm; Topology: Buck-Boost; Width: 2.5mm; ComponentLink1URL: https://octopart.com:443/opatz8j6/c1?t=gNq7TF7tSc49575p1d7uQl57FG5jDcXkBMLDW126I0WEQXkIA098L7NZ_qYIg46R_mEVXP1ZudpvOxjPLOhYoc06XnsUOV98jXAUQjPdW1_iilG_HodZwudlgmeapdYC8MAuybCwXlRSug8DpFgDV6n19M2t72yPupKnKBICJAZReI5Lq1DGSmAwUp7QA5MYuFyWz9dU1JD3eDKFwEa58FXMp_CwZg0PtROB0XhS2GMmy06385Rr9d3ZI0uVTLlC2W9932pjiund1zMk-BM6Pzi5pbwXOYVWoA5-yh00xZrcV1pvqKriKK6xtSp4eHkE3zoXcOTJDfsL5RkPJugosAbBFYdKExzLzKYtWdpNjWSChq_8Wr0YsJke445TpHqaXJCaFbe7Tg&src-supplier=Texas+Instruments; ComponentLink1Description: https://octopart.com:443/opatz8j6/c1?t=gNq7TF7tSc49575p1d7uQl57FG5jDcXkBMLDW126I0WEQXkIA098L7NZ_qYIg46R_mEVXP1ZudpvOxjPLOhYoc06XnsUOV98jXAUQjPdW1_iilG_HodZwudlgmeapdYC8MAuybCwXlRSug8DpFgDV6n19M2t72yPupKnKBICJAZReI5Lq1DGSmAwUp7QA5MYuFyWz9dU1JD3eDKFwEa58FXMp_CwZg0PtROB0XhS2GMmy06385Rr9d3ZI0uVTLlC2W9932pjiund1zMk-BM6Pzi5pbwXOYVWoA5-yh00xZrcV1pvqKriKK6xtSp4eHkE3zoXcOTJDfsL5RkPJugosAbBFYdKExzLzKYtWdpNjWSChq_8Wr0YsJke445TpHqaXJCaFbe7Tg&src-supplier=Texas+Instruments; ComponentLink2URL: http://sigma.octopart.com:80/reach_statement/Texas-Instruments-company-64.pdf?src-supplier=Compliance+Statements; ComponentLink2Description: http://sigma.octopart.com:80/reach_statement/Texas-Instruments-company-64.pdf?src-supplier=Compliance+Statements; ComponentLink3URL: http://sigma.octopart.com:80/conflict_mineral_statement/Texas-Instruments-company-63.pdf?src-supplier=Compliance+Statements; ComponentLink3Description: http://sigma.octopart.com:80/conflict_mineral_statement/Texas-Instruments-company-63.pdf?src-supplier=Compliance+Statements
U4 = BQ25180YBGR: 5.5V /Polymer 1 1A DSBGA-8(1.1x1.6) Battery Management ICs ROHS; Manufacturer: Texas Instruments; Manufacturer Lifecycle Status: ACTIVE; Supplier: DigiKey; Supplier Part Number: 296-BQ25180YBGRCT-ND; Manufacturer Part Number: BQ25180YBGR; RoHS: Compliant; Category: Battery Management; Stock: 1782; Pricing: 1=3.01, 10=2.253, 25=2.0632, 100=1.854, 250=1.75436, 500=1.72278 (USD); Height: 500µm; Length: 1.2mm; Lifecycle Status: Production; Pins: 8; Thickness: 254µm; Width: 800µm; ComponentLink1URL: https://sigma.octopart.com:443/155720082/technical_drawing/Texas-Instruments-BQ25180YBGR.pdf?src-supplier=Texas+Instruments; ComponentLink1Description: https://sigma.octopart.com:443/155720082/technical_drawing/Texas-Instruments-BQ25180YBGR.pdf?src-supplier=Texas+Instruments; ComponentLink2URL: https://octopart.com:443/opatz8j6/c1?t=FgRCWYcMJHsZPNpfPzz_WR8vIqjwGMfRa0SdsFniFhPrh3vtdb6GhY6GHejVJgTUlbG4lFRXPlj5NxyYPwhbiYG4p17xkGQBD2p7YHYOAcHS2yUZr_WlZrBFbhb-UonEzVnaB5Ghr5vXkXqoEGqeoR7xOrtJrfoIGfJgWSYXlAKIjkMxwBT0EYjR8qqClumHTeDOTKrCcHE7gK9esH017LNumf_XquhCrPrOa7UbX9POSFM-OWMENnwvHC5BcqHpHp9BI5ef5ZRVnJ8IHWDtm02aX9O4Snlux5T14TkZJlWxTf4x7K0DU-zLtI6wQdNVHB0h9aazHM3I_eYPwzS32m5K0TB4PgRJn0dCtC1nh5xbwKs842dX9HlMeUuaaw4PMgLO2TU&src-supplier=Texas+Instruments; ComponentLink2Description: https://octopart.com:443/opatz8j6/c1?t=FgRCWYcMJHsZPNpfPzz_WR8vIqjwGMfRa0SdsFniFhPrh3vtdb6GhY6GHejVJgTUlbG4lFRXPlj5NxyYPwhbiYG4p17xkGQBD2p7YHYOAcHS2yUZr_WlZrBFbhb-UonEzVnaB5Ghr5vXkXqoEGqeoR7xOrtJrfoIGfJgWSYXlAKIjkMxwBT0EYjR8qqClumHTeDOTKrCcHE7gK9esH017LNumf_XquhCrPrOa7UbX9POSFM-OWMENnwvHC5BcqHpHp9BI5ef5ZRVnJ8IHWDtm02aX9O4Snlux5T14TkZJlWxTf4x7K0DU-zLtI6wQdNVHB0h9aazHM3I_eYPwzS32m5K0TB4PgRJn0dCtC1nh5xbwKs842dX9HlMeUuaaw4PMgLO2TU&src-supplier=Texas+Instruments; ComponentLink3URL: https://datasheet.octopart.com:443/BQ25180YBGR-Texas-Instruments-datasheet-165811111.pdf?src-supplier=Augswan; ComponentLink3Description: https://datasheet.octopart.com:443/BQ25180YBGR-Texas-Instruments-datasheet-165811111.pdf?src-supplier=Augswan; ComponentLink4URL: https://datasheet.octopart.com:443/BQ25180YBGR-Texas-Instruments-datasheet-169738557.pdf?src-supplier=LCSC; ComponentLink4Description: https://datasheet.octopart.com:443/BQ25180YBGR-Texas-Instruments-datasheet-169738557.pdf?src-supplier=LCSC; ComponentLink5URL: http://sigma.octopart.com:80/reach_statement/Texas-Instruments-company-64.pdf?src-supplier=Compliance+Statements; ComponentLink5Description: http://sigma.octopart.com:80/reach_statement/Texas-Instruments-company-64.pdf?src-supplier=Compliance+Statements; ComponentLink6URL: http://sigma.octopart.com:80/conflict_mineral_statement/Texas-Instruments-company-63.pdf?src-supplier=Compliance+Statements; ComponentLink6Description: http://sigma.octopart.com:80/conflict_mineral_statement/Texas-Instruments-company-63.pdf?src-supplier=Compliance+Statements